# EAGLE design Aquarium_PCB (EAGLE 9.2.2)
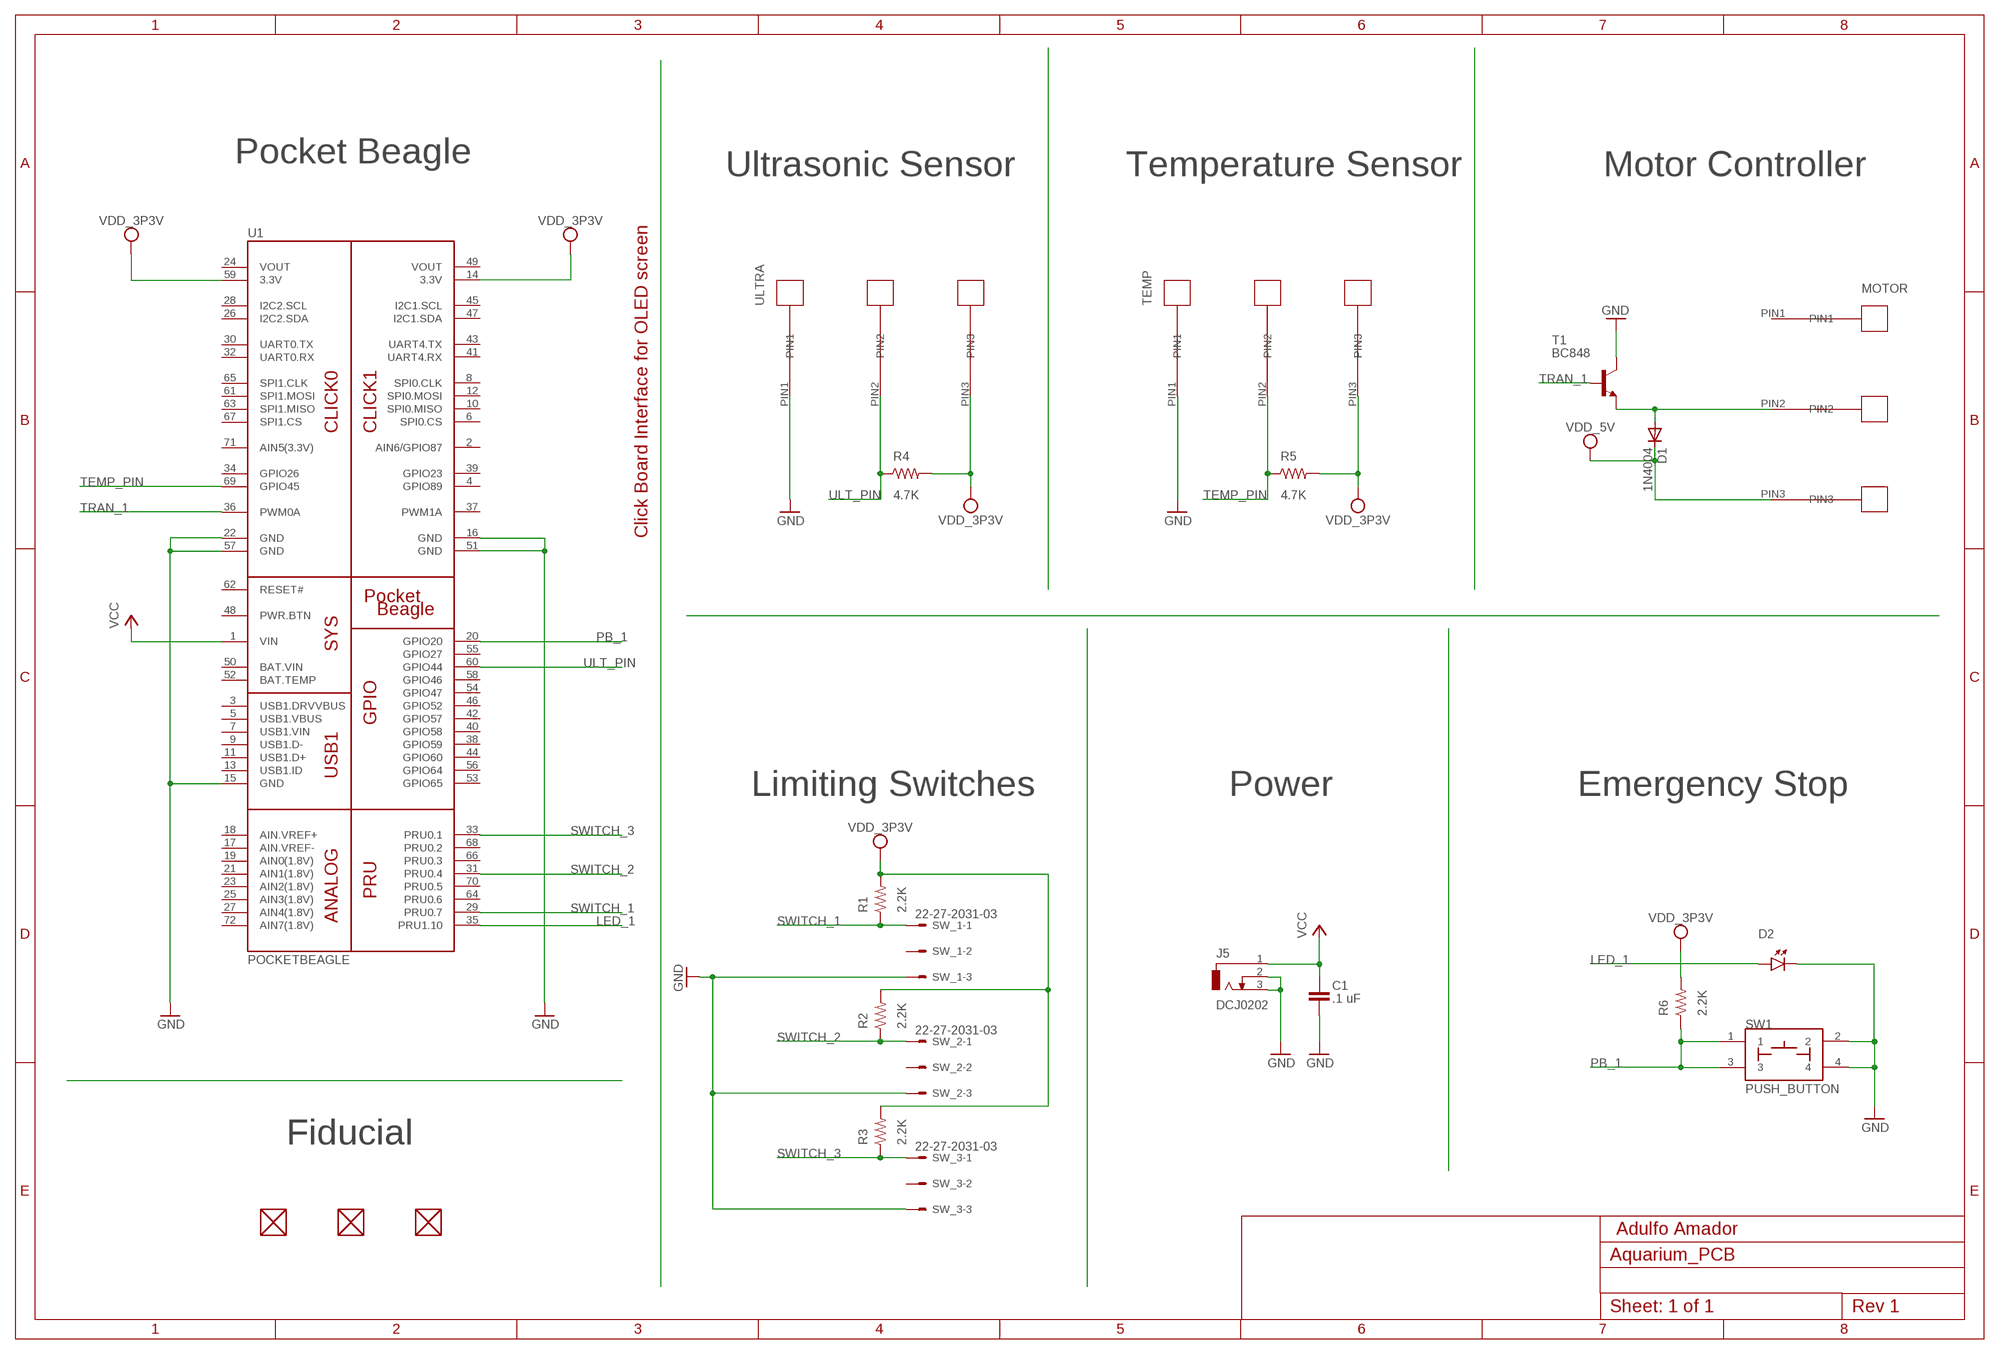
[diagram p0: schematic, sheet 1]

## Parts
C1  .1 uF  C_C0603  [C0603]
D1  1N4004  [DO41-10]
D2  LTST-C191TBKT  [LED]
FUD1  FIDUCIAL  [FIDUCIAL_40MIL]
FUD2  FIDUCIAL  [FIDUCIAL_40MIL]
FUD3  FIDUCIAL  [FIDUCIAL_40MIL]
J5  DCJ0202  [DCJ0202]
MOTOR  BM03B-AUHKS-GA-TB  [AUXILIARY_CONNECTOR]
R1  2.2K  R_R0603  [R0603]
R2  2.2K  R_R0603  [R0603]
R3  2.2K  R_R0603  [R0603]
R4  4.7K  R_R0603  [R0603]
R5  4.7K  R_R0603  [R0603]
R6  2.2K  R_R0603  [R0603]
SW1  PUSH_BUTTON  [BUTTON_12.5MM]
SW_1  22-27-2031-03  [6410-03]
SW_2  22-27-2031-03  [6410-03]
SW_3  22-27-2031-03  [6410-03]
T1  BC848  [SOT23]
TEMP  BM03B-AUHKS-GA-TB  [AUXILIARY_CONNECTOR]
U1  POCKETBEAGLE  [POCKETBEAGLE]
ULTRA  BM03B-AUHKS-GA-TB  [AUXILIARY_CONNECTOR]

## Nets
GND: C1.2 D2.C J5.2 J5.3 SW1.2 SW1.4 SW_1.3 SW_2.3 SW_3.3 T1.3(C) TEMP.PIN1 U1.15(GND) U1.16(GND) U1.22(GND) U1.51(GND) U1.57(GND) ULTRA.PIN1
GND_MOTOR: D1.A MOTOR.PIN2 T1.2(E)
LED_1: D2.A U1.35(PRU1.10)
PB_1: R6.1 SW1.1 SW1.3 U1.20(GPIO20)
PWR_MOTOR: D1.C MOTOR.PIN3 ; supply symbol labelled VDD_5V
SWITCH_1: R1.1 SW_1.1 U1.29(PRU0.7)
SWITCH_2: R2.1 SW_2.1 U1.31(PRU0.4)
SWITCH_3: R3.1 SW_3.1 U1.33(PRU0.1)
TEMP_PIN: R5.1 TEMP.PIN2 U1.69(GPIO45)
TRAN_1: T1.1(B) U1.36(PWM0A)
ULT_PIN: R4.1 U1.60(GPIO44) ULTRA.PIN2
VCC: C1.1 J5.1 U1.1(VIN)
VDD_3P3V: R1.2 R2.2 R3.2 R4.2 R5.2 R6.2 TEMP.PIN3 U1.14(3.3V) U1.59(3.3V) ULTRA.PIN3
Unconnected: FUD1.P$1 FUD2.P$1 FUD3.P$1 MOTOR.PIN1 SW_1.2 SW_2.2 SW_3.2 U1.2(AIN6/GPIO87) U1.3(USB1.DRVVBUS) U1.4(GPIO89) U1.5(USB1.VBUS) U1.6(SPI0.CS) U1.7(USB1.VIN) U1.8(SPI0.CLK) U1.9(USB1.D-) U1.10(SPI0.MISO) U1.11(USB1.D+) U1.12(SPI0.MOSI) U1.13(USB1.ID) U1.17(AIN.VREF-) U1.18(AIN.VREF+) U1.19(AIN0(1.8V)) U1.21(AIN1(1.8V)) U1.23(AIN2(1.8V)) U1.25(AIN3(1.8V)) U1.26(I2C2.SDA) U1.27(AIN4(1.8V)) U1.28(I2C2.SCL) U1.30(UART0.TX) U1.32(UART0.RX) U1.34(GPIO26) U1.37(PWM1A) U1.38(GPIO59) U1.39(GPIO23) U1.40(GPIO58) U1.41(UART4.RX) U1.42(GPIO57) U1.43(UART4.TX) U1.44(GPIO60) U1.45(I2C1.SCL) U1.46(GPIO52) U1.47(I2C1.SDA) U1.48(PWR.BTN) U1.52(BAT.TEMP) U1.53(GPIO65) U1.54(GPIO47) U1.55(GPIO27) U1.56(GPIO64) U1.58(GPIO46) U1.61(SPI1.MOSI) U1.62(RESET#) U1.63(SPI1.MISO) U1.64(PRU0.6) U1.65(SPI1.CLK) U1.66(PRU0.3) U1.67(SPI1.CS) U1.68(PRU0.2) U1.70(PRU0.5) U1.71(AIN5(3.3V)) U1.72(AIN7(1.8V))

## Notes on the sheet
- Pocket Beagle
- Ultrasonic Sensor | Temperature Sensor | Motor Controller
- Click Board Interface for OLED screen
- Limiting Switches | Power | Emergency Stop
- Fiducial
- Adulfo Amador
- 1 of 1

## Power pins joined to a net without a drawn wire
BAT.VIN: U1.50(BAT.VIN)
VOUT: U1.24(VOUT) U1.49(VOUT)

## Library data of the parts
C1 = ENGI301:C_: Capacitor SMD. Sizes: 0402, 0603 & 0805
D1 = diode:1N4004: DIODE general purpose rectifier, 1 A
D2 = Dulfy_Library:LTST-C191TBKT
FUD1-FUD3 = ENGI301:FIDUCIAL
J5 = con-jack:DCJ0202: DC POWER JACK Source: DCJ0202.pdf; OC_FARNELL: unknown; OC_NEWARK: unknown
MOTOR TEMP ULTRA = Dulfy_Library:BM03B-AUHKS-GA-TB
R1-R6 = ENGI301:R_: RESISTOR, American symbol
SW1 = ENGI301:PUSH_BUTTON
SW_1-SW_3 = con-molex:22-?-03: CONNECTOR wire to board 2.54 mm (.1 inch) pitch header; MF: MOLEX; OC_FARNELL: unknown; OC_NEWARK: unknown
T1 = transistor:BC848: NPN TRANSISTOR
U1 = ENGI301:POCKETBEAGLE

## Board
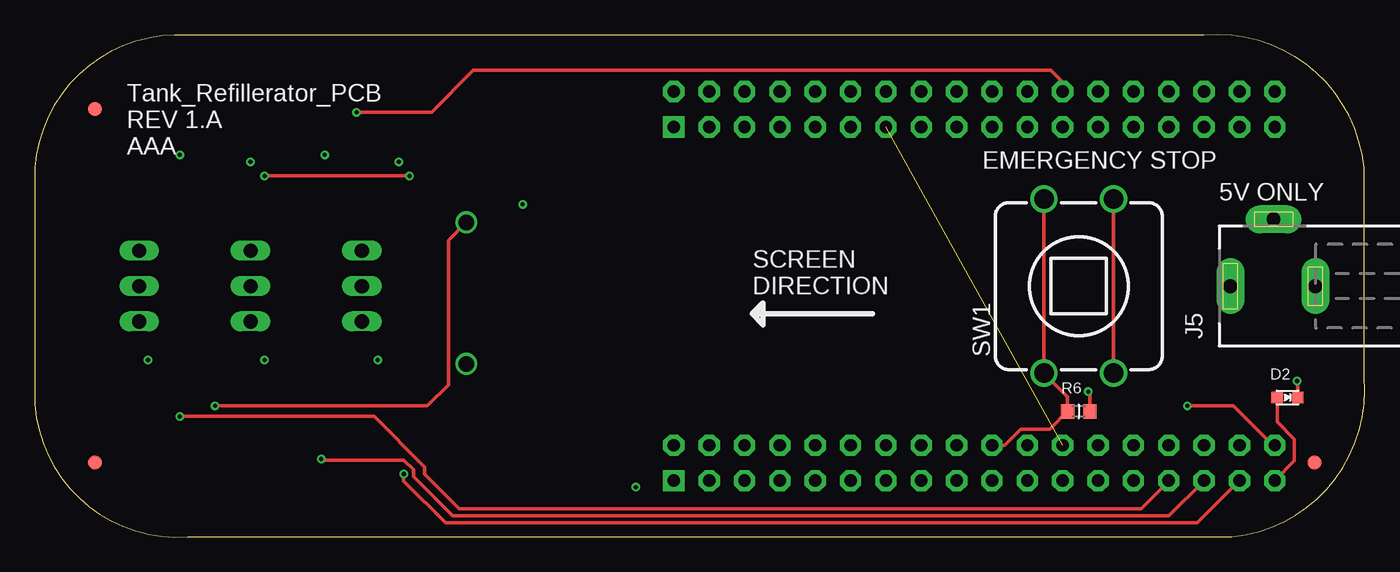
[diagram p1: board, top side]
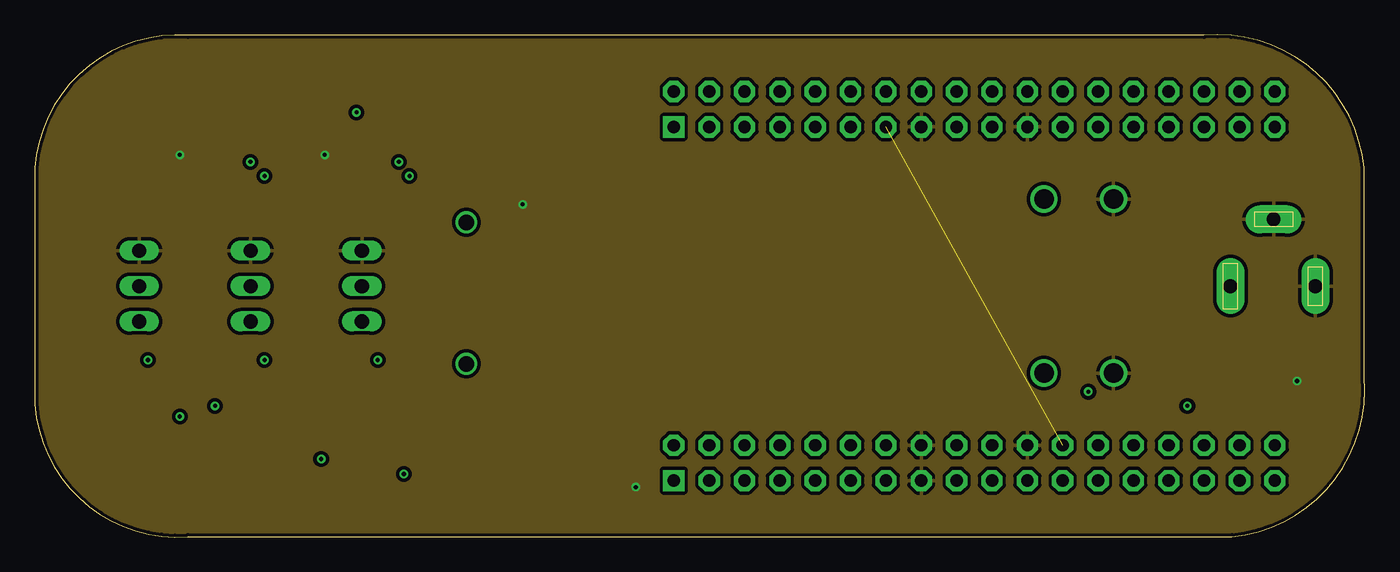
[diagram p2: board, inner layer Route2]
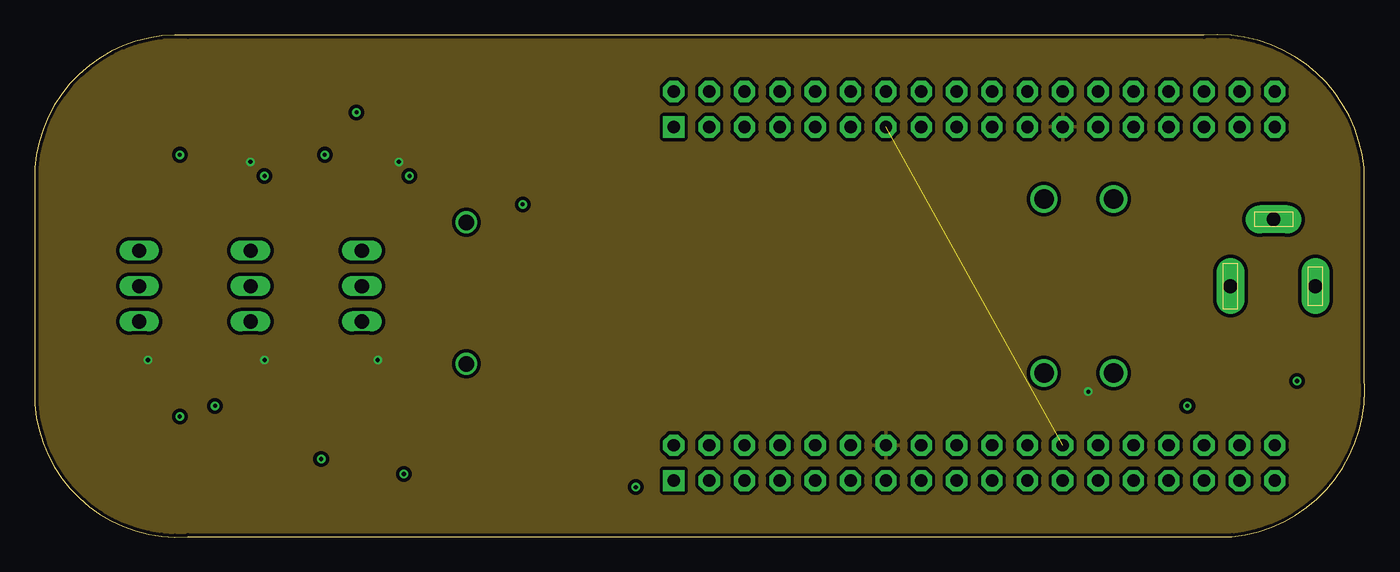
[diagram p3: board, inner layer Route15]
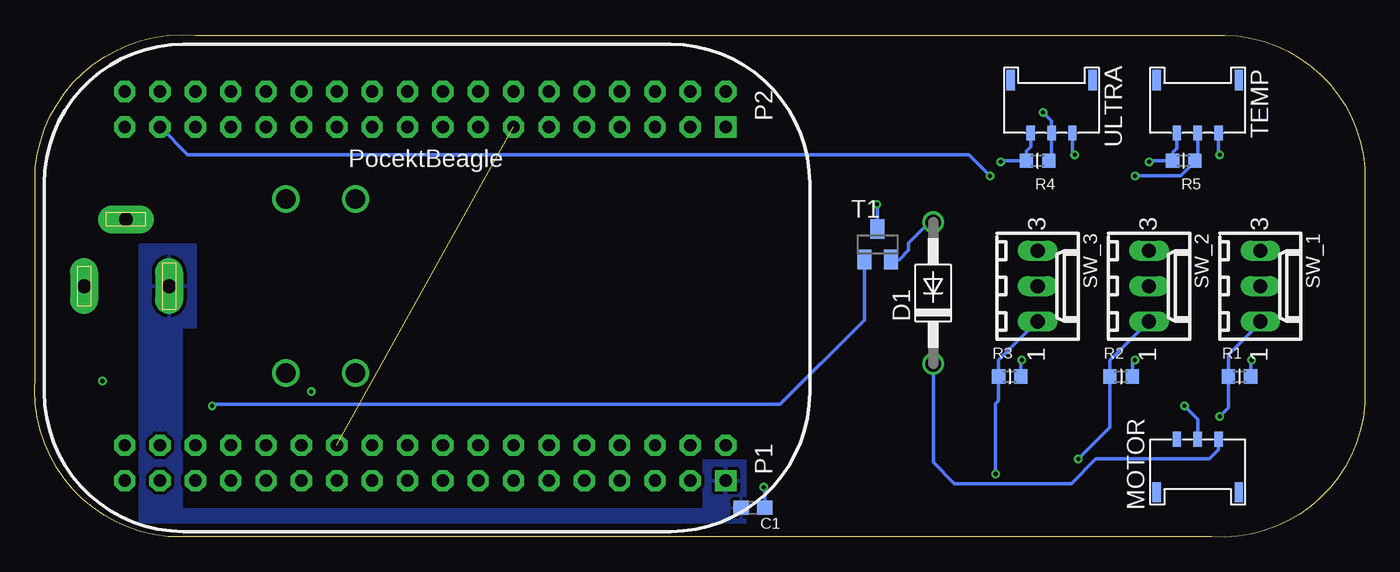
[diagram p4: board, bottom side, seen from below]

Size 95.55 x 36.07 mm. Coordinates in mm from the lower left corner, seen from the top.
Outline: 0,9.53 arc90 11,0.03 86,0.03 arc90 95.5,11.53 95.5,26.53 arc90 84,36.03 11,36.03 arc90 0,26.53 0,9.53
Copper layers (1*2*15*16): Top 0.035mm / dielectric 0.23mm / Route2 0.035mm / dielectric 0.93mm / Route15 0.035mm / dielectric 0.23mm / Bottom 0.035mm
Design rules "ENGI301_4lyr": minimum track width 10mil, minimum drill 12mil, track to track 10mil, track to pad 10mil, pad to pad 10mil, via to via 10mil, smd to smd 10mil, copper to edge 10mil, drill to drill 12mil, minimum pad ring 6mil, minimum via ring 6mil, stop-mask expansion 3mil, vias tented up to drill 25mil, thermal gap 10mil

### Footprints (pad centres in the part's own frame; a part is rotated, then mirrored left to right if it is on the bottom)
C0603 = smd 1.1 x 1: 1 -0.85,0; 2 0.85,0
DO41-10 = drill 1.118: A 5.08,0; C -5.08,0
LED = smd 0.8 x 0.8: A -0.75,0; C 0.75,0
FIDUCIAL_40MIL = smd 1.016 x 1.016: P$1 0,0
DCJ0202 = drill 1 pad 2 long: 1 0,3.1; 2 4.8,0; 3 0,-3
AUXILIARY_CONNECTOR = smd 1.45 x 0.6: P$4 -3.8,-2.95; P$5 -3.8,2.95 | smd 1.05 x 0.6: PIN1 0,1.5; PIN2 0,0; PIN3 0,-1.5
R0603 = smd 0.95 x 1.031: 1 -0.8,0; 2 0.8,0
BUTTON_12.5MM = drill 1.4: 1 -6.25,2.5; 2 -6.25,-2.5; 3 6.25,2.5; 4 6.25,-2.5
6410-03 = drill 1.016 long: 1 2.54,0; 2 0,0; 3 -2.54,0
SOT23 = smd 1 x 1.4: 1 -0.95,-1.1; 2 0.95,-1.1; 3 0,1.1
POCKETBEAGLE = drill 0.889 pad 1.524 square: 1 5.91,3.53; 37 5.91,28.93 | drill 0.889 pad 1.524 octagon: 2 5.91,6.07; 3 8.45,3.53; 4 8.45,6.07; 5 10.99,3.53; 6 10.99,6.07; 7 13.53,3.53; 8 13.53,6.07; 9 16.07,3.53; 10 16.07,6.07; 11 18.61,3.53; 12 18.61,6.07; 13 21.15,3.53; 14 21.15,6.07; 15 23.69,3.53; 16 23.69,6.07; 17 26.23,3.53; 18 26.23,6.07; 19 28.77,3.53; 20 28.77,6.07; 21 31.31,3.53; 22 31.31,6.07; 23 33.85,3.53; 24 33.85,6.07; 25 36.39,3.53; 26 36.39,6.07; 27 38.93,3.53; 28 38.93,6.07; 29 41.47,3.53; 30 41.47,6.07; 31 44.01,3.53; 32 44.01,6.07; 33 46.55,3.53; 34 46.55,6.07; 35 49.09,3.53; 36 49.09,6.07; 38 5.91,31.47; 39 8.45,28.93; 40 8.45,31.47; 41 10.99,28.93; 42 10.99,31.47; 43 13.53,28.93; 44 13.53,31.47; 45 16.07,28.93; 46 16.07,31.47; 47 18.61,28.93; 48 18.61,31.47; 49 21.15,28.93; 50 21.15,31.47; 51 23.69,28.93; 52 23.69,31.47; 53 26.23,28.93; 54 26.23,31.47; 55 28.77,28.93; 56 28.77,31.47; 57 31.31,28.93; 58 31.31,31.47; 59 33.85,28.93; 60 33.85,31.47; 61 36.39,28.93; 62 36.39,31.47; 63 38.93,28.93; 64 38.93,31.47; 65 41.47,28.93; 66 41.47,31.47; 67 44.01,28.93; 68 44.01,31.47; 69 46.55,28.93; 70 46.55,31.47; 71 49.09,28.93; 72 49.09,31.47

### Placement (x,y rotation side)
C1  43.95,2.1 0 bottom
D1  31,17.53 90 bottom
D2  90,10.03 0 top
FUD1  4.32,30.76 0 top
FUD2  4.32,5.36 0 top
FUD3  91.95,5.36 0 top
J5  89,18.03 90 top
MOTOR  12,7.03 90 bottom
R1  9,11.53 0 bottom
R2  17.5,11.53 0 bottom
R3  25.5,11.53 0 bottom
R4  23.5,27.03 180 bottom
R5  13,27.03 180 bottom
R6  75,9.03 0 top
SW1  75,18.03 90 top
SW_1  7.5,18.03 270 bottom
SW_2  15.5,18.03 270 bottom
SW_3  23.5,18.03 270 bottom
T1  35,21.03 0 bottom
TEMP  12,29.03 270 bottom
U1  40,0.53 0 top
ULTRA  22.5,29.03 270 bottom

### Tracks (layer width: path | path; a pad name or v marks a point on that pad's centre or on a via)
GND  (via drill 0.3 pad 0.61)
  Top 0.254: SW1.2 SW1.4 | D2.C 90.75,11.13 v90.68,11.2
  Bottom 0.254: v35.05,23.9 35,23.85 T1.3 | TEMP.PIN1 10.5,27.54 v10.41,27.46 | ULTRA.PIN1 21,27.63 v20.83,27.46 | C1.2 43.1,3.5 v43.18,3.58
  pour Route2: -1,-0.97 -1,37.03 97,37.03 97,-0.97
GND_MOTOR  (via drill 0.3 pad 0.61)
  Top 0.254: v12.95,9.42 28.19,9.42 29.72,10.95 29.72,21.32 D1.A 31.27,22.61
  Bottom 0.254: T1.2 33.44,19.93 32.77,20.6 32.77,21.11 31.27,22.61 D1.A | v12.95,9.42 12,8.47 MOTOR.PIN2
LED_1
  Top 0.254: D2.A 89.25,8.28 90.5,7.03 90.5,5.47 U1.35
PB_1
  Top 0.254: U1.20 69.69,6.6 70.84,7.74 72.91,7.74 R6.1 74.2,10.08 72.61,11.67 SW1.1 SW1.3
PWR_MOTOR
  Bottom 0.254: MOTOR.PIN3 10.5,6.29 11.18,5.61 19.3,5.61 21.08,3.84 29.46,3.84 30.99,5.36 30.99,12.43 D1.C
SWITCH_1  (via drill 0.3 pad 0.61)
  Top 0.254: U1.29 81.47,4.01 79.5,2.04 30.48,2.04 28,4.53 28,5.03 24.36,8.66 v10.41,8.66
  Bottom 0.254: SW_1.1 7.5,15.39 9.8,13.09 R1.1 9.8,9.28 v10.41,8.66
SWITCH_2  (via drill 0.3 pad 0.61)
  Top 0.254: U1.31 81.49,1.53 30,1.53 27.21,4.33 27.21,4.82 26.5,5.53 20.66,5.53 v20.57,5.61
  Bottom 0.254: v20.57,5.61 18.3,7.89 R2.1 18.3,12.69 SW_2.1
SWITCH_3  (via drill 0.3 pad 0.61)
  Top 0.254: U1.33 83.52,1.03 29.5,1.03 26.5,4.03 26.5,4.51 v26.52,4.53
  Bottom 0.254: SW_3.1 26.3,12.69 R3.1 26.3,9.79 26.52,9.57 v26.52,4.53
TEMP_PIN  (via drill 0.3 pad 0.61)
  Top 0.254: v16.51,25.93 v26.92,25.93
  Bottom 0.254: TEMP.PIN2 12,27.23 R5.1 12.2,26.94 13.21,25.93 v16.51,25.93 | U1.69 84.55,27.46 28.7,27.46 28.45,27.46 v26.92,25.93
TRAN_1  (via drill 0.3 pad 0.61)
  Top 0.254: v82.8,9.42 86.11,9.42 88.93,6.6 U1.36
  Bottom 0.254: T1.1 35.95,15.58 42,9.53 81.79,9.53 81.84,9.53 82.7,9.53 v82.8,9.42
ULT_PIN  (via drill 0.3 pad 0.61)
  Top 0.254: U1.60 73.85,32.68 73,33.53 31.5,33.53 28.5,30.53 23.13,30.53 v23.11,30.51
  Bottom 0.254: R4.1 22.5,27.23 ULTRA.PIN2 22.5,29.89 v23.11,30.51
VCC
  pour Bottom: 84,21.03 84,15.03 85,15.03 85,2.03 47.5,2.03 47.5,5.53 44.5,5.53 44.5,1.03 88,1.03 88,21.03
VDD_3P3V  (via drill 0.3 pad 0.61)
  Top 0.254: R6.2 75.8,10.33 v75.69,10.44
  Bottom 0.254: ULTRA.PIN3 24,28.03 24.3,27.73 R4.2 26.09,27.03 v26.16,26.95 | TEMP.PIN3 13.5,27.93 13.8,27.63 R5.2 15.42,27.03 v15.49,26.95 | R2.2 16.7,12.54 v16.51,12.73 | R1.2 8.2,12.65 v8.13,12.73 | R3.2 24.7,12.66 v24.64,12.73
  pour Route15: -2,38.03 -2,-1.97 98,-1.97 98,38.03
VOUT  (1 unrouted)

### Text on the board
tPlace: Tank_Refillerator_PCB / REV 1.A / AAA | EMERGENCY STOP | 5V ONLY | SCREEN / DIRECTION